# EAGLE design Teste (EAGLE 9.1.0)
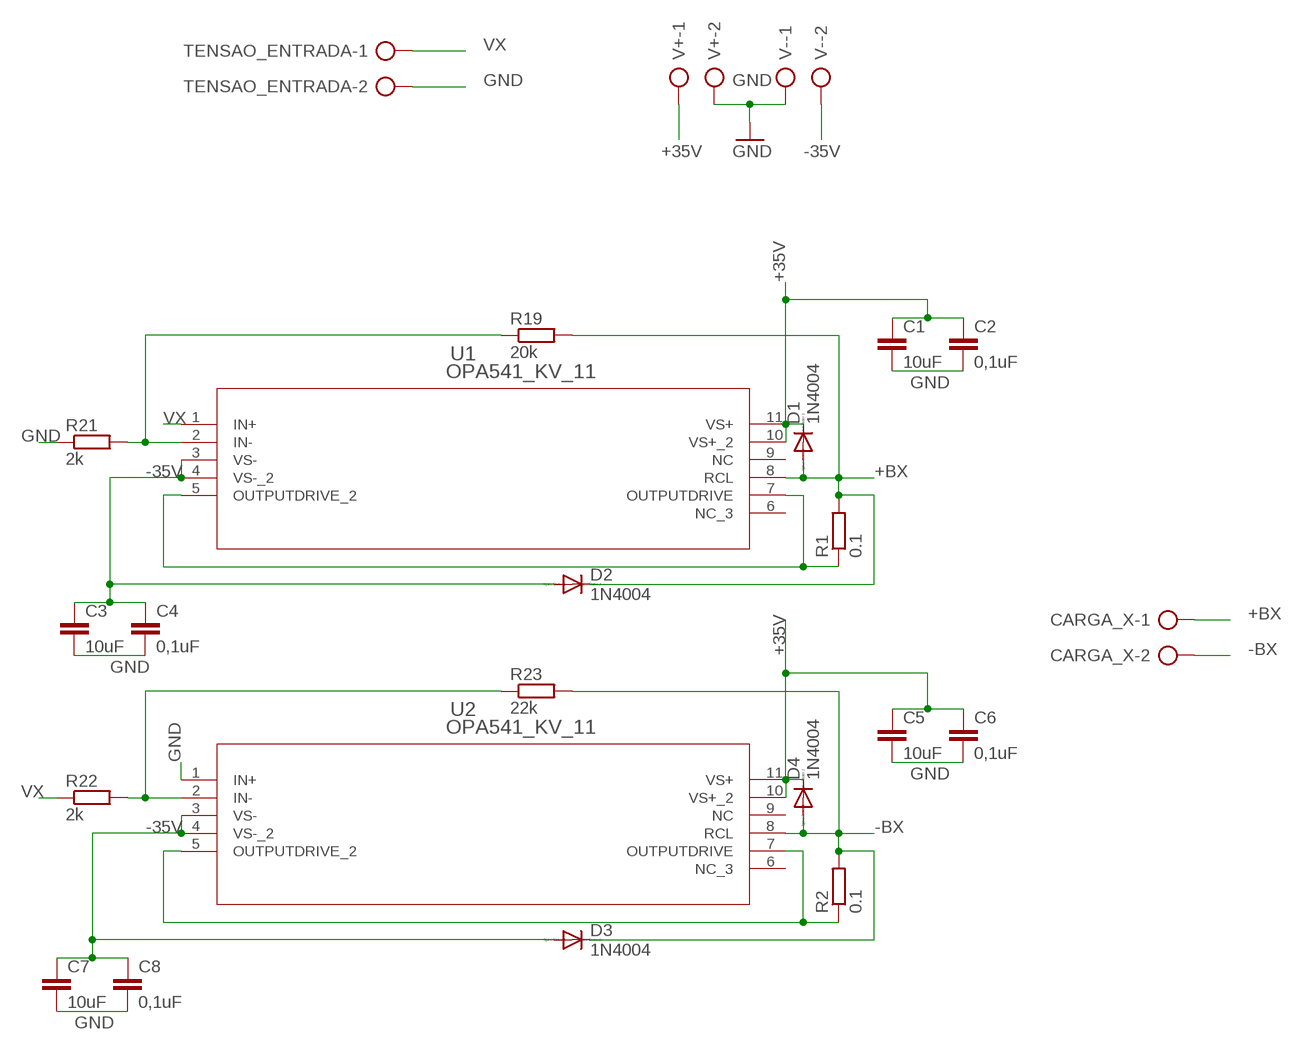
[diagram p0: schematic, sheet 1]

## Parts
C1  10uF  C-EU025-024X044  [C025-024X044]
C2  0,1uF  C-EU025-024X044  [C025-024X044]
C3  10uF  C-EU025-024X044  [C025-024X044]
C4  0,1uF  C-EU025-024X044  [C025-024X044]
C5  10uF  C-EU025-024X044  [C025-024X044]
C6  0,1uF  C-EU025-024X044  [C025-024X044]
C7  10uF  C-EU025-024X044  [C025-024X044]
C8  0,1uF  C-EU025-024X044  [C025-024X044]
CARGA_X  AK500/2-H  [AK500/2-H]
D1  1N4004  [DO41-10]
D2  1N4004  [DO41-10]
D3  1N4004  [DO41-10]
D4  1N4004  [DO41-10]
R1  0.1  R-EU_0204/7  [0204/7]
R2  0.1  R-EU_0204/7  [0204/7]
R19  20k  R-EU_0207/7  [0207/7]
R21  2k  R-EU_0207/7  [0207/7]
R22  2k  R-EU_0207/7  [0207/7]
R23  22k  R-EU_0207/7  [0207/7]
TENSAO_ENTRADA  AK500/2-H  [AK500/2-H]
U1  OPA541_KV_11  [KV11]
U2  OPA541_KV_11  [KV11]
V+  AK500/2-H  [AK500/2-H]
V-  AK500/2-H  [AK500/2-H]

## Nets
+35V: C1.1 C2.1 C5.1 C6.1 D1.C D4.C U1.10(VS+_2) U1.11(VS+) U2.10(VS+_2) U2.11(VS+) V+.1
+BX: CARGA_X.1 D1.A D2.C R1.2 R19.2 U1.8(RCL)
-35V: C3.1 C4.1 C7.1 C8.1 D2.A D3.A U1.3(VS-) U1.4(VS-_2) U2.3(VS-) U2.4(VS-_2) V-.2
-BX: CARGA_X.2 D3.C D4.A R2.2 R23.2 U2.8(RCL)
GND: C1.2 C2.2 C3.2 C4.2 C5.2 C6.2 C7.2 C8.2 R21.1 TENSAO_ENTRADA.2 U2.1(IN+) V+.2 V-.1
N$1: R19.1 R21.2 U1.2(IN-)
N$2: R2.1 U2.5(OUTPUTDRIVE_2) U2.7(OUTPUTDRIVE)
N$3: R1.1 U1.5(OUTPUTDRIVE_2) U1.7(OUTPUTDRIVE)
N$7: R22.2 R23.1 U2.2(IN-)
VX: R22.1 TENSAO_ENTRADA.1 U1.1(IN+)
Unconnected: U1.6(NC_3) U1.9(NC) U2.6(NC_3) U2.9(NC)

## Library data of the parts
C1-C8 = rcl:C-EU: CAPACITOR, European symbol; SPICEPREFIX: C
CARGA_X TENSAO_ENTRADA V+ V- = con-ptr500:AK500/2-H: CONNECTOR Aug. 2004 / PTR Meßtechnik: Die Bezeichnung der Serie AK505 wurde geändert. Es handelt sich hierbei um AK500 in horizontaler Ausführung.; OC_FARNELL: unknown; OC_NEWARK: unknown
D1-D4 = diode:1N4004: DIODE general purpose rectifier, 1 A
R1 R2 R19 R21-R23 = resistor:R-EU_: RESISTOR, European symbol
U1 U2 = customizados:OPA541_KV_11; MANUFACTURER_PART_NUMBER: opa541_kv_11; VENDOR: Texas Instruments

## Board
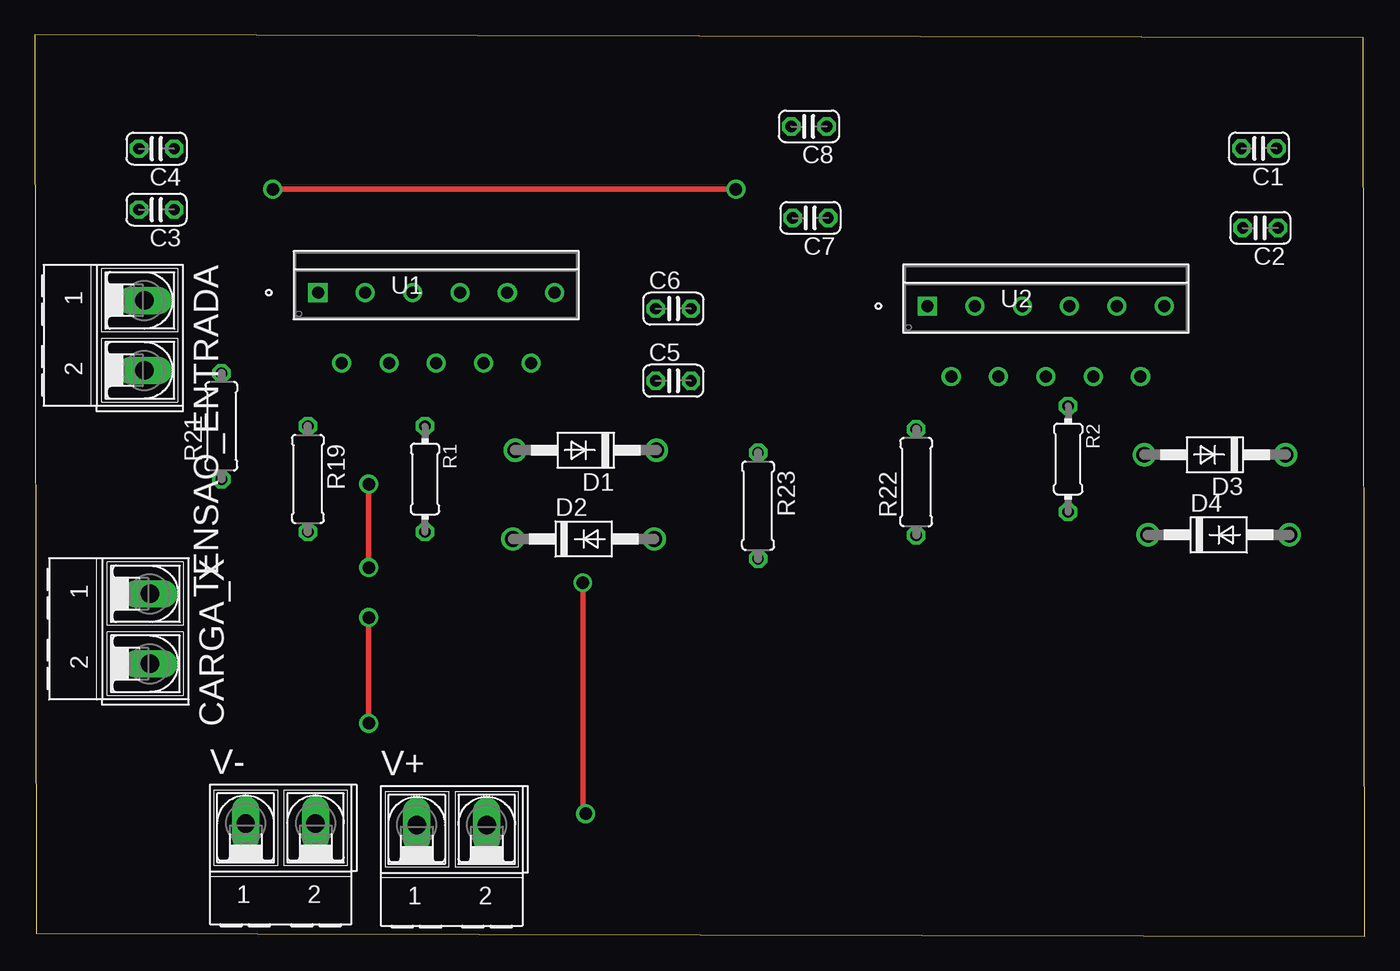
[diagram p1: board, top side]
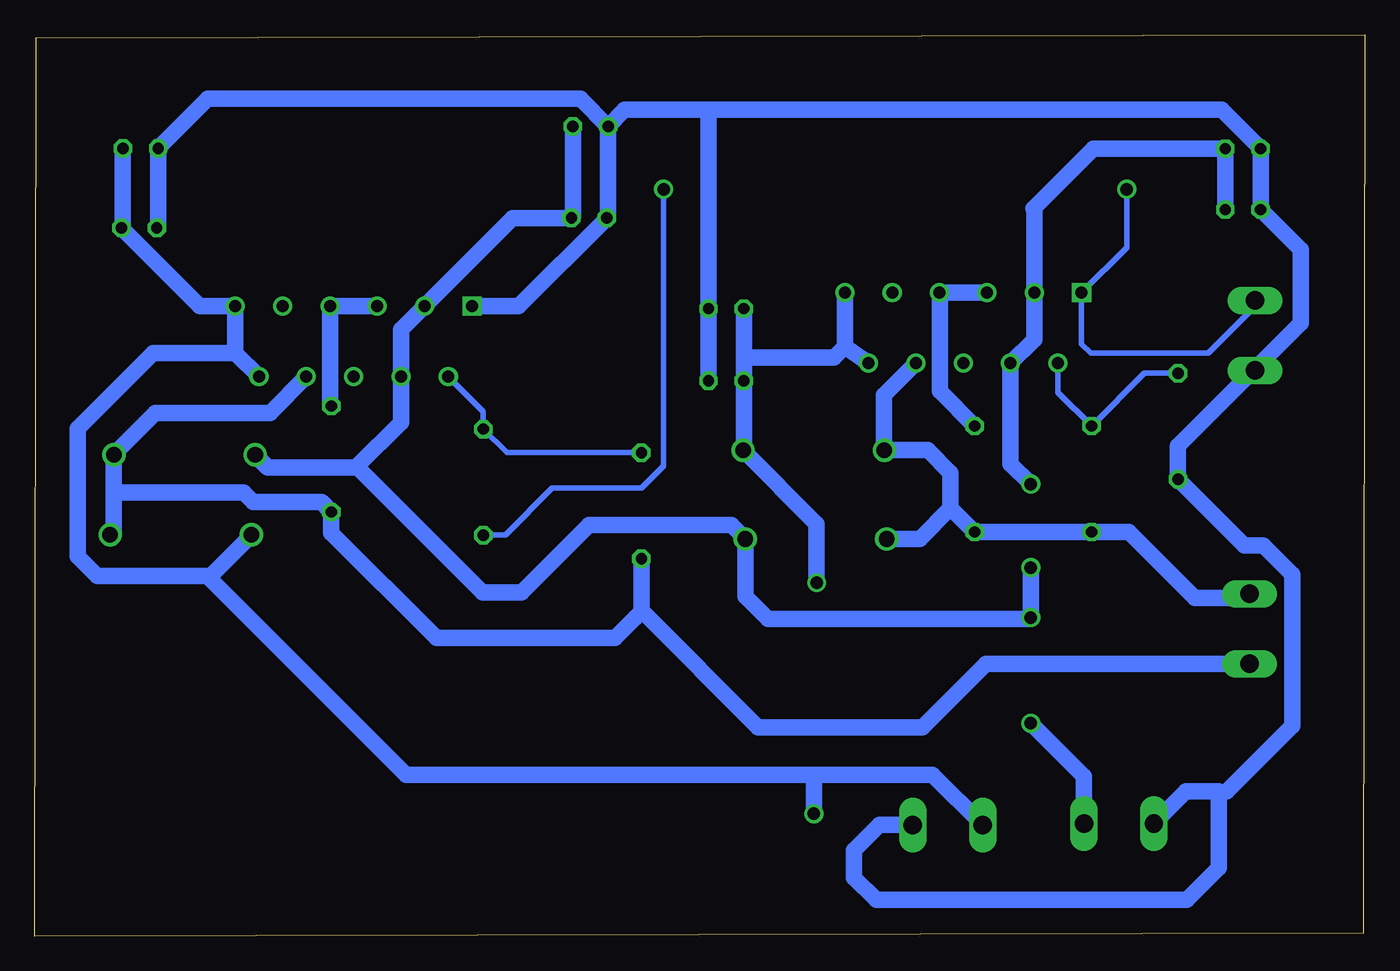
[diagram p2: board, bottom side, seen from below]

Size 95.6 x 64.8 mm. Coordinates in mm from the lower left corner, seen from the top.
Outline: 0.1,0.2 95.6,0 95.5,64.6 0,64.8 0.1,0.2
Copper layers (1*16): Top 0.035mm / dielectric 1.5mm / Bottom 0.035mm
Design rules "default *": minimum track width 16mil, minimum drill 0.35mm, track to track 14mil, track to pad 14mil, pad to pad 14mil, via to via 14mil, smd to smd 14mil, copper to edge 40mil, drill to drill 6mil, minimum pad ring 10mil, minimum via ring 8mil, stop-mask expansion 4mil, vias tented up to drill 0mil, thermal gap 10mil

### Footprints (pad centres in the part's own frame; a part is rotated, then mirrored left to right if it is on the bottom)
C025-024X044 = drill 0.813 octagon: 1 -1.27,0; 2 1.27,0
AK500/2-H = drill 1.321 long: 1 -2.515,0; 2 2.515,0
DO41-10 = drill 1.118: A 5.08,0; C -5.08,0
0204/7 = drill 0.813 octagon: 1 -3.81,0; 2 3.81,0
0207/7 = drill 0.813 octagon: 1 -3.81,0; 2 3.81,0
KV11 = drill 0.864 pad 1.372 square: 1 -17.018,-1.067 | drill 0.864 pad 1.372: 2 -15.316,-6.147; 3 -13.614,-1.067; 4 -11.913,-6.147; 5 -10.211,-1.067; 6 -8.509,-6.147; 7 -6.807,-1.067; 8 -5.105,-6.147; 9 -3.404,-1.067; 10 -1.702,-6.147; 11 0,-1.067

### Placement (x,y rotation side)
C1  88,56.63 180 top
C2  88.1,50.91 180 top
C3  8.75,52.23 180 top
C4  8.75,56.61 180 top
C5  45.9,39.93 0 top
C6  45.9,45.11 0 top
C7  55.75,51.63 180 top
C8  55.65,58.21 180 top
CARGA_X  8.27,22.09 270 top
D1  39.61,34.93 180 top
D2  39.45,28.55 0 top
D3  84.84,34.61 180 top
D4  85.1,28.85 0 top
R1  28.05,32.86 270 top
R2  74.28,34.3 270 top
R19  19.63,32.86 270 top
R21  13.42,36.66 90 top
R22  63.36,32.64 90 top
R23  51.99,30.94 270 top
TENSAO_ENTRADA  7.87,43.19 270 top
U1  37.37,47.33 0 top
U2  81.19,46.36 0 top
V+  29.97,7.99 0 top
V-  17.67,8.09 0 top

### Tracks (layer width: path | path; a pad name or v marks a point on that pad's centre or on a via)
+35V  (via drill 0.6, 0.9)
  Top 0.406: v39.4,25.4 39.4,9 v39.6,8.8
  Bottom 0.406: 37.23,42.29 37.37,42.38 | 44.63,34.99 D1.C | 82.97,25.9 83.2,25.9 | 42.4,11.6 44.9,11.6 | C2.1 89.33,50.87 89.27,50.93 | 39.6,11.5 39.7,11.6
  Bottom 1.2: U1.11 37.37,42.38 38.16,41.6 44.43,41.6 44.63,41.8 | 44.63,34.99 C5.1 44.63,41.8 | U2.10 81.19,41.91 | 81.19,41.91 U2.11 83.75,45.29 89.33,50.87 | D4.C 82.97,25.9 | 81.19,41.91 87.08,41.91 92.5,36.5 92.5,27.3 91.1,25.9 83.2,25.9 68.9,11.6 44.9,11.6 39.7,11.6 31.06,11.6 V+.1 | U1.10 37.23,42.29 | D1.C 39.4,29.64 v39.4,25.4 | C1.1 89.27,50.93 | v39.6,8.8 39.6,11.5 | 44.63,41.8 C6.1
+BX
  Bottom 0.406: 8.57,24.3 CARGA_X.1
  Bottom 1.2: 29.77,30.77 R1.2 R19.2 16.95,29.05 12.2,24.3 8.57,24.3 | 29.77,30.77 29.77,33.3 31.4,34.93 32.27,34.93 | D1.A 32.27,34.93 | 32.27,34.93 34.56,34.93 34.56,38.88 U1.8 | D2.C 31.98,28.55 29.77,30.77
-35V  (via drill 0.6, 0.9)
  Top 0.406: v24,32.5 v24,26.5 | v24,22.9 v24,15.3
  Bottom 0.406: 23.8,52.3 23.76,52.26 | 69.28,36.48 69.28,36.92 | 24.1,22.8 v24,22.9
  Bottom 1.2: U1.3 23.76,45.7 | 23.76,45.7 23.76,42.88 U1.4 25.46,33.96 v24,32.5 | D3.A 78.85,33.7 72.5,33.7 | C3.1 C4.1 19.49,56.61 23.8,52.3 | 23.76,52.26 23.76,45.7 | v24,15.3 20.18,11.49 V-.2 | C8.1 56.92,51.73 C7.1 61.24,51.63 U2.3 69.28,43.59 U2.4 69.28,36.92 72.45,33.75 63.4,24.7 60.6,24.7 55.75,29.55 45.53,29.55 D2.A 44.53,24.43 42.9,22.8 24.1,22.8 | v24,26.5 v24,22.9
-BX
  Bottom 0.406: 89.92,29.11 D4.A | 89.82,31.8 89.92,31.9 | 51.99,23.33 52.46,22.86
  Bottom 1.2: 89.92,31.9 D3.C 86.93,37.6 78.7,37.6 U2.8 | 89.92,31.9 89.92,29.11 | CARGA_X.2 27.23,19.58 31.8,15 43.6,15 51.96,23.36 52.46,22.86 53.89,21.43 66.72,21.43 74.28,28.99 R2.2 74.99,31.2 79.9,31.2 80.6,31.9 89.92,31.9 | R23.2 51.99,23.33
GND
  Bottom 0.406: 9.9,10.4 10.5,10.4 | 86.73,51.01 C2.2 | 47.17,59.37 47.2,59.4
  Bottom 1.2: C5.2 C6.2 47.17,59.37 | C8.2 56.37,60.2 83.16,60.2 C1.2 86.73,51.01 | V-.1 12.84,10.4 10.5,10.4 10.5,4.9 12.8,2.6 35.1,2.6 36.7,4.2 36.7,6.17 34.88,7.99 V+.2 | 9.9,10.4 5.2,15.1 5.2,26 7.3,28.1 8.67,28.1 R21.1 13.42,35.25 7.87,40.8 | C8.2 54.38,51.73 C7.2 60.82,45.29 U2.1 | C8.2 53.19,59.4 47.2,59.4 10.27,59.4 C4.2 C3.2 4.6,49.35 4.6,44.07 7.87,40.8 | 7.87,40.8 TENSAO_ENTRADA.2
N$1
  Bottom 0.406: R21.2 15.83,40.47 R19.1 22.05,39.09 U1.2
N$2
  Bottom 0.406: U2.7
  Bottom 1.2: U2.5 U2.7 | U2.7 74.38,38.21 R2.1
N$3
  Bottom 1.2: U1.5 U1.7 30.55,39.17 R1.1
N$4  (via drill 0.6)
  other vias: 24,15.3
N$5  (via drill 0.6)
  other vias: 17.1,53.7
N$6  (via drill 0.6)
  other vias: 50.4,53.7
N$7
  Bottom 0.406: U2.2 63.36,37.7 R22.2 61.66,34.75 R23.1
N$8  (via drill 0.6)
  other vias: 39.6,8.8
VX  (via drill 0.9)
  Top 0.406: v50.4,53.7 v17.1,53.7
  Bottom 0.406: TENSAO_ENTRADA.1 7.87,45.3 11.26,41.91 19.7,41.91 20.35,42.56 U1.1 17.1,49.52 v17.1,53.7 | R22.1 61.77,28.83 58.4,32.2 52,32.2 50.4,33.8 v50.4,53.7